# Altium schematic sheet mx8m_pmic.SchDoc (part 2 of 3)
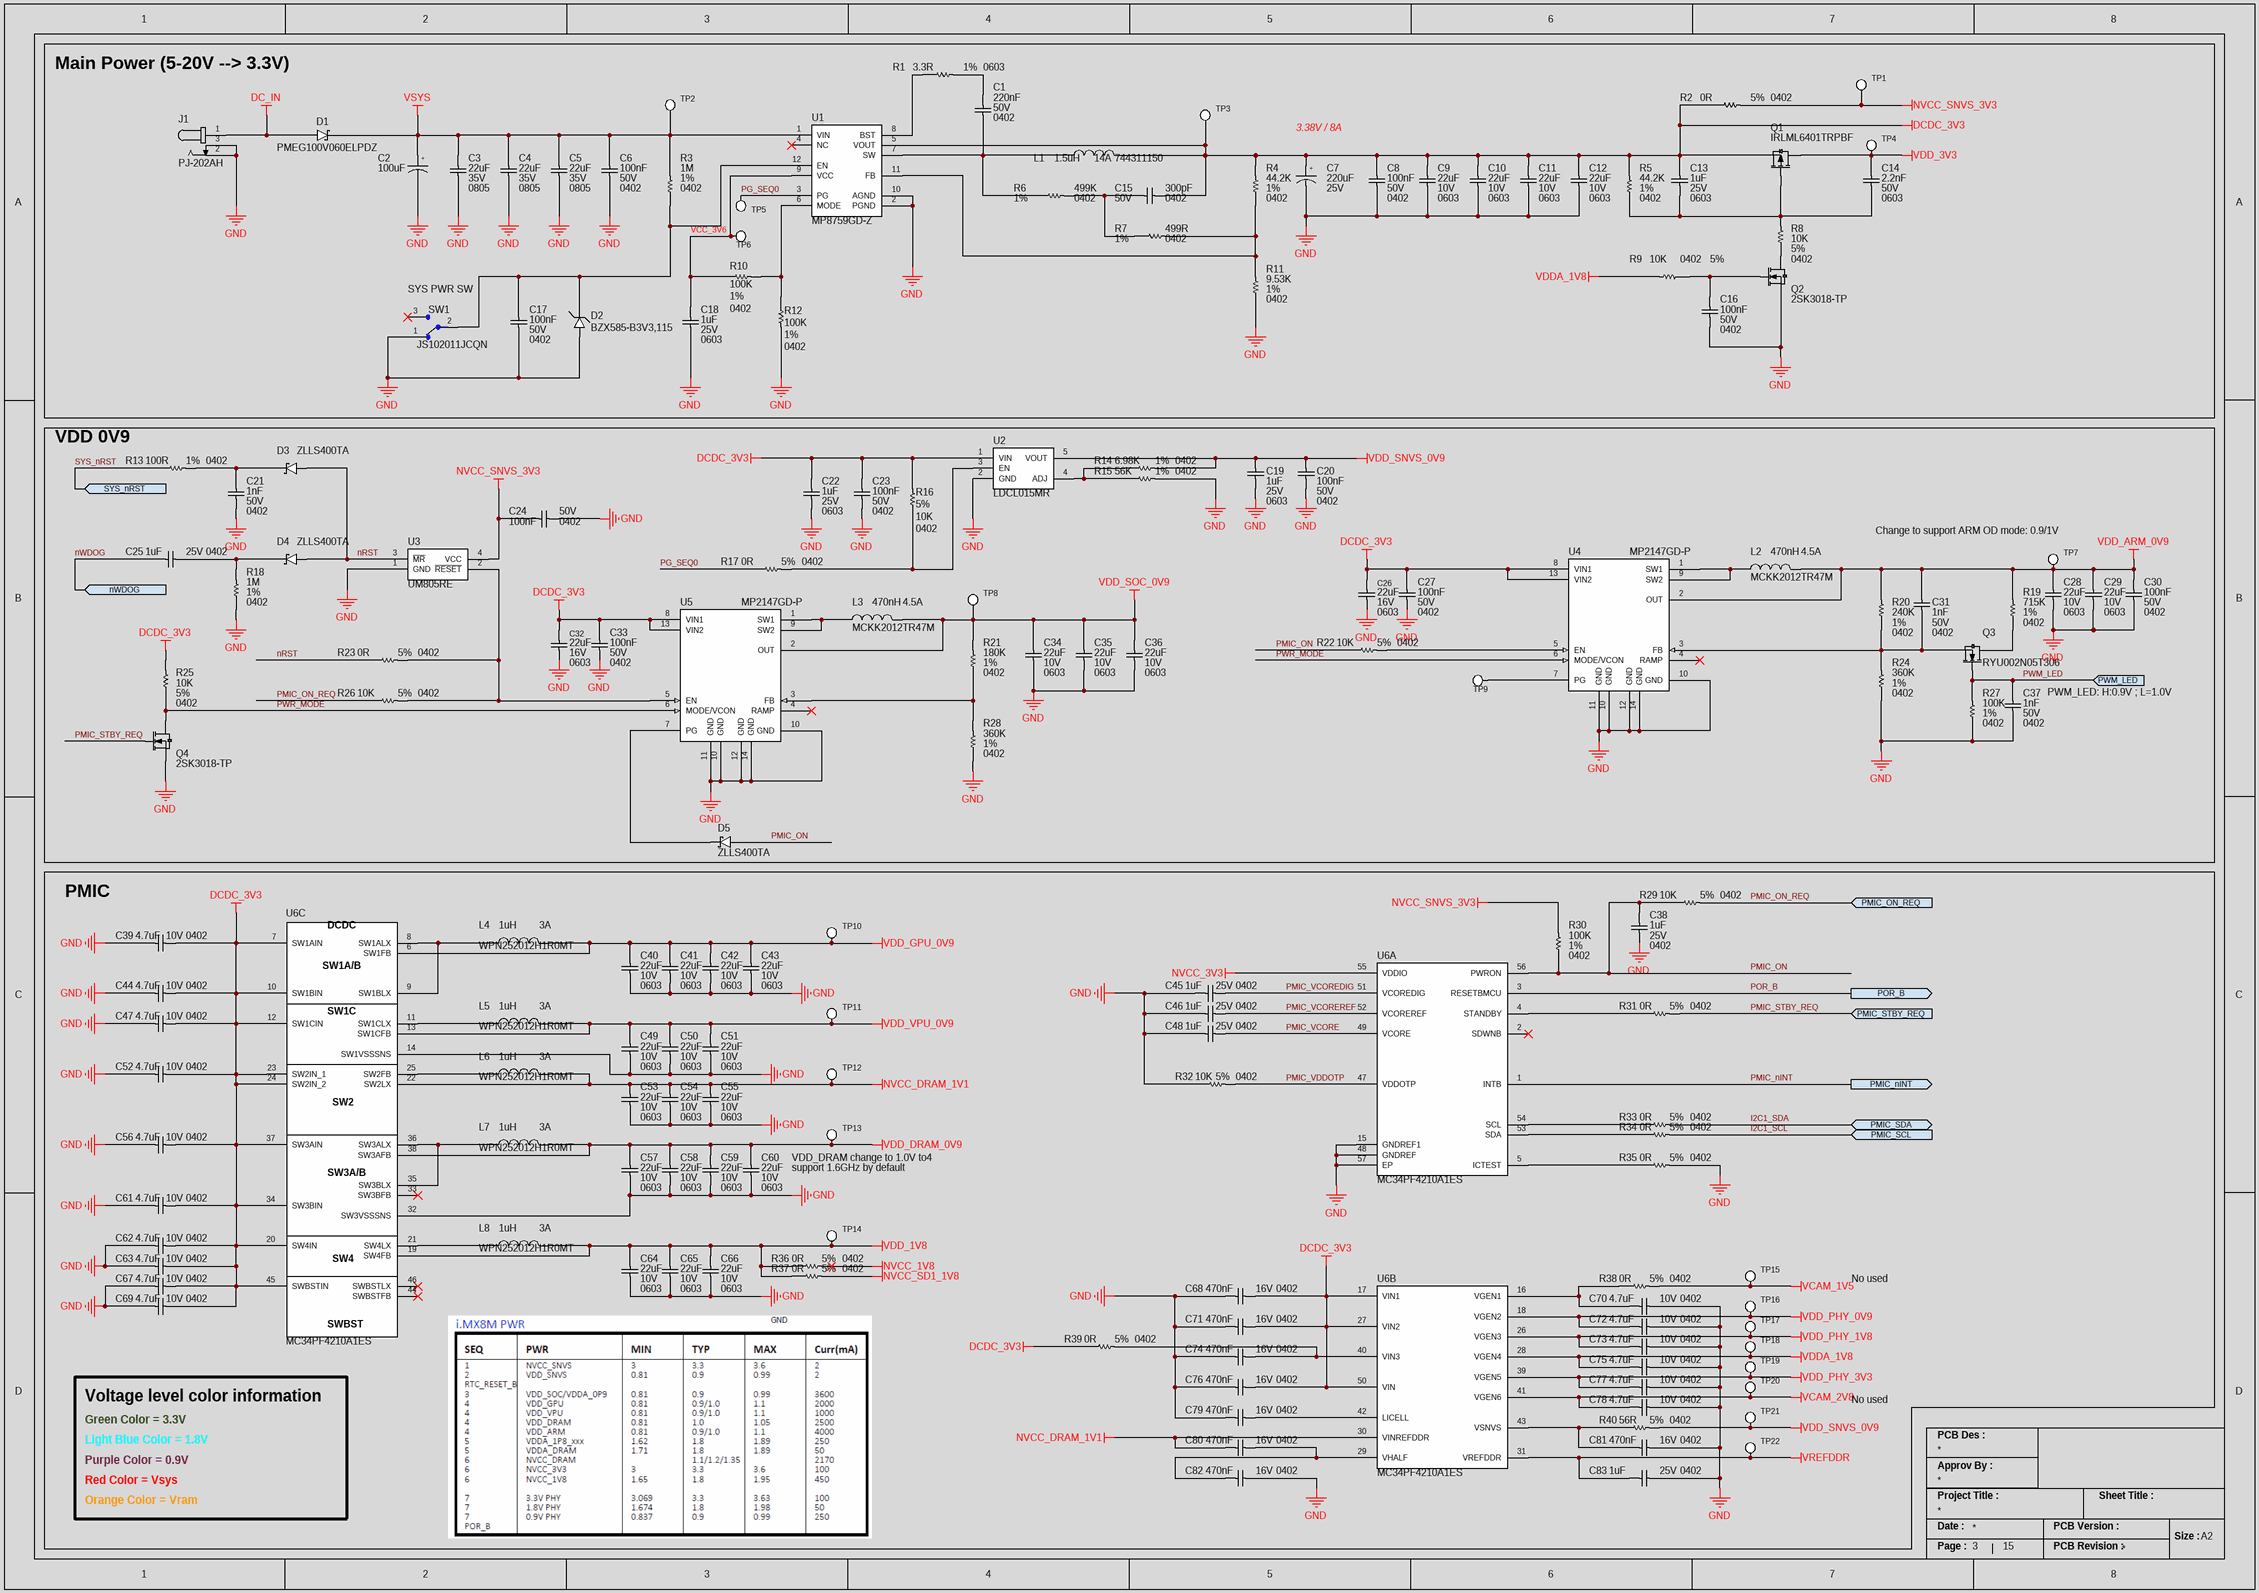
[diagram p1: mx8m_pmic.SchDoc]
## Library data of the parts
C1 = CAP_0.22UF_50V_X5R_0402: Multilayer Ceramic Capacitor, 0.22 uF, 50 VDC, ± 10%, X5R, 0402 [1005 Metric]; Manufacturer: Murata; Material: 4241ConductorMaterial; Dielectric: 1537DielectricType; Supplier 1: Digi-Key; Manufacturer Part Number: GRM155R61H224KE01W; RoHS: No; Category: Ceramic Capacitors; Stock 1: 74638; Pricing 1: 1=0.1, 10=0.048, 50=0.0272, 100=0.0212, 500=0.01592, 1000=0.01251, 2500=0.01138, 5000=0.01046 (USD); Min Operating Temperature: -55°C; Max Operating Temperature: 85°C; Voltage Rating: 50V; Length: 1mm; Width: 500um; Height: 550um; Thickness: 500um; Supplier Part Number 1: 490-GRM155R61H224KE01WCT-ND
C2 = CAP_100UF_50V_POL: Radial Can - SMD ALUMINUM ELECTROLYTIC CAPACITOR UUD 50V 100muF ±20% 0.315Dia 8.00mm; Manufacturer: Nichicon; Dielectric Material: Aluminium; Ripple Current (AC): 300mA; Impedance: 340mR; Leakage Current: 3uA; Life (Hours): 5000Hour; Dissipation Factor: 0.14%; Polarity: 5066Direction; Lead Diameter: 1.1mm; Supplier 1: Mouser; Manufacturer Part Number: UUD1H101MNL1GS; RoHS: Yes; Category: Aluminum Electrolytic Capacitors; Stock 1: 2204; Pricing 1: 1=0.53, 10=0.313, 50=0.313, 100=0.202, 500=0.202, 1000=0.171, 2500=0.151, 10000=0.138, 25000=0.136, 50000=0.131 (USD); Case/Package: Radial; Number of Pins: 2; Min Operating Temperature: -55°C; Max Operating Temperature: 105°C; Tolerance: 20%; Voltage Rating (DC): 50V; Package Quantity: 500; Ripple Current: 300mA; Packaging: Tape and Reel; Voltage Rating: 50V; Termination: SMD/SMT; Voltage: 50V; Series: UD; Construction: Cylindrical; Voltage Rating (AC): 50V; Diameter: 8mm; Length: 10mm; Height: 10mm; Lead Pitch: 3.1mm; Height - Seated (Max): 0.394inch; Radiation Hardening: No; Reach SVHC Compliant: No; Lead Free: Lead Free; RoHS Compliant: Yes; ComponentLink1URL: https://datasheet.ciiva.com/11781/0900766b80fa39e7-11781901.pdf?src-supplier=Rs; ComponentLink1Description: https://datasheet.ciiva.com/11781/0900766b80fa39e7-11781901.pdf?src-supplier=Rs; ComponentLink2URL: https://datasheet.ciiva.com/28458/e-ud-28458117.pdf?src-supplier=Element14; ComponentLink2Description: https://datasheet.ciiva.com/28458/e-ud-28458117.pdf?src-supplier=Element14; ComponentLink3URL: https://datasheet.ciiva.com/28458/1910936-28458133.pdf?src-supplier=Element14; ComponentLink3Description: https://datasheet.ciiva.com/28458/1910936-28458133.pdf?src-supplier=Element14; ComponentLink4URL: https://datasheet.ciiva.com/7781/66055-7781450.pdf?src-supplier=Element14; ComponentLink4Description: https://datasheet.ciiva.com/7781/66055-7781450.pdf?src-supplier=Element14; ComponentLink5URL: https://datasheet.ciiva.com/5362/e-ud-5362134.pdf?src-supplier=Mouser; ComponentLink5Description: https://datasheet.ciiva.com/5362/e-ud-5362134.pdf?src-supplier=Mouser; Supplier Part Number 1: 647-UUD1H101MNL
C3-C5 = CAP_22uF_35V_X5R_0805: Commercial Grade, 0805, X5R, 35V, 22; Manufacturer: TDK; Supplier 1: Digikey; Manufacturer Part Number: C2012X5R1V226M125DC; RoHS: No; Category: Ceramic Capacitors; Stock 1: 17855; Pricing 1: 1=0.97, 10=0.595, 50=0.4452, 100=0.3986, 500=0.31924, 1000=0.29446, 2500=0.26812, 5000=0.25213 (USD); Supplier Part Number 1: 445-C2012X5R1V226M125DCCT-ND
C6 C8 C16 C17 C20 C23 C24 C27 C30 C33 = CAP_100NF_50V_X7R_0402: Multilayer Ceramic Capacitor, 0.1 uF, 16 V, ± 10%, X7R, 0402 [1005 Metric]; Manufacturer: Murata; Dissipation Factor: 0.025%; Temperature Coefficient: 30ppm/°C; Supplier 1: DigiKey; Manufacturer Part Number: GRM155R71H104KE14D; RoHS: Yes; Category: Ceramic Capacitors; Stock 1: 13730790; Pricing 1: 1=0.1, 10=0.023, 50=0.0132, 100=0.0102, 500=0.00768, 1000=0.00603, 2500=0.00548, 5000=0.00504 (USD); Mount: Surface Mount; Number of Pins: 2NUMBER; Case Code (Metric): 1005; Material: Ceramic; Case Code (Imperial): 0402; Weight: 0.000212oz; Dielectric Material: Ceramic; Min Operating Temperature: -55°C; Max Operating Temperature: 125°C; Packaging: Tape and Reel; Package Quantity: 10000; Series: GRM; Tolerance: 10%; Dielectric: X7R; Termination: SMD/SMT; Voltage: 50V; Voltage Rating (DC): 50V; Construction: Flat; Length: 1mm; Width: 0.5mm; Height: 0.5mm; Depth: 0.5mm; Thickness: 0.022inch; Reach SVHC Compliant: No; RoHS Compliant: Yes; Lead Free: 5697LeadFree; ComponentLink1URL: http://www.farnell.com/datasheets/2079156.pdf?src-supplier=Farnell; ComponentLink1Description: http://www.farnell.com/datasheets/2079156.pdf?src-supplier=Farnell; ComponentLink2URL: http://www.mouser.com/ds/2/281/c02e-2905.pdf?src-supplier=Mouser; ComponentLink2Description: http://www.mouser.com/ds/2/281/c02e-2905.pdf?src-supplier=Mouser; ComponentLink3URL: http://www.farnell.com/datasheets/2079156.pdf?src-supplier=Newark; ComponentLink3Description: http://www.farnell.com/datasheets/2079156.pdf?src-supplier=Newark; ComponentLink4URL: https://datasheet.octopart.com/GRM155R71H104KE14D-Murata-datasheet-22122223.pdf?src-supplier=Future+Electronics; ComponentLink4Description: https://datasheet.octopart.com/GRM155R71H104KE14D-Murata-datasheet-22122223.pdf?src-supplier=Future+Electronics; ComponentLink5URL: https://search.murata.co.jp/Ceramy/image/img/A01X/G101/ENG/GRM155R71H104KE14-01.pdf?src-supplier=Digi-Key; ComponentLink5Description: https://search.murata.co.jp/Ceramy/image/img/A01X/G101/ENG/GRM155R71H104KE14-01.pdf?src-supplier=Digi-Key; ComponentLink6URL: http://psearch.en.murata.com/capacitor/product/GRM155R71H104KE14%23.pdf?src-supplier=Avnet; ComponentLink6Description: http://psearch.en.murata.com/capacitor/product/GRM155R71H104KE14%23.pdf?src-supplier=Avnet; ComponentLink7URL: https://datasheet.octopart.com/GRM155R71H104KE14D-Murata-datasheet-66077078.pdf?src-supplier=Element14; ComponentLink7Description: https://datasheet.octopart.com/GRM155R71H104KE14D-Murata-datasheet-66077078.pdf?src-supplier=Element14; Supplier Part Number 1: 490-10700-6-ND; Supplier 2: Digikey; Stock 2: 3706055; Pricing 2: 1=0.1, 10=0.037, 50=0.021, 100=0.0162, 500=0.01224, 1000=0.00961, 2500=0.00874, 5000=0.00804 (USD); Halogen Free: 5694HalogenFree; ComponentLink8URL: http://www.mouser.com/ds/2/447/UPY-GPHC_X5R_4V-to-50V_25-1131599.pdf?src-supplier=Mouser; ComponentLink8Description: http://www.mouser.com/ds/2/447/UPY-GPHC_X5R_4V-to-50V_25-1131599.pdf?src-supplier=Mouser; ComponentLink9URL: https://datasheet.octopart.com/CC0402KRX5R8BB104-Yageo-datasheet-137700082.pdf?src-supplier=Future+Electronics; ComponentLink9Description: https://datasheet.octopart.com/CC0402KRX5R8BB104-Yageo-datasheet-137700082.pdf?src-supplier=Future+Electronics; ComponentLink10URL: http://www.yageo.com/documents/recent/UPY-GPHC_X5R_4V-to-50V_25.pdf?src-supplier=Digikey; ComponentLink10Description: http://www.yageo.com/documents/recent/UPY-GPHC_X5R_4V-to-50V_25.pdf?src-supplier=Digikey; ComponentLink11URL: https://datasheet.octopart.com/CC0402KRX5R8BB104-Yageo-datasheet-140260304.pdf?src-supplier=Newark; ComponentLink11Description: https://datasheet.octopart.com/CC0402KRX5R8BB104-Yageo-datasheet-140260304.pdf?src-supplier=Newark; ComponentLink12URL: https://datasheet.octopart.com/CC0402KRX5R8BB104-Yageo-datasheet-170350636.pdf?src-supplier=Future+Electronics; ComponentLink12Description: https://datasheet.octopart.com/CC0402KRX5R8BB104-Yageo-datasheet-170350636.pdf?src-supplier=Future+Electronics; ComponentLink13URL: http://www.yageo.com/documents/recent/UPY-GPHC_X5R_4V-to-50V-16.pdf?src-supplier=Future+Electronics; ComponentLink13Description: http://www.yageo.com/documents/recent/UPY-GPHC_X5R_4V-to-50V-16.pdf?src-supplier=Future+Electronics; Supplier Part Number 2: 311-1697-1-ND
C7 = CAP_220uF_EEV227M025A9MAA: Cap Aluminum Lytic 220uF 25V 20% (8 X 10.2mm) SMD 600mA 2000h 105C T/R; Manufacturer: KEMET; ESR (Equivalent Series Resistance): 160mR; Supplier 1: Digikey; Manufacturer Part Number: EEV227M025A9MAA; RoHS: Yes; Category: Capacitors; Stock 1: 20821; Pricing 1: 1=0.58, 10=0.39, 50=0.3102, 100=0.2562 (USD); Mount: Surface Mount; Case/Package: Radial; Min Operating Temperature: -55°C; Max Operating Temperature: 105°C; Series: EEV; Packaging: Cut Tape; Tolerance: 20%; Impedance: 160mR; RoHS Compliant: Yes; ComponentLink1URL: https://datasheet.octopart.com/EEV227M025A9MAA-KEMET-datasheet-130072785.pdf?src-supplier=Farnell; ComponentLink1Description: https://datasheet.octopart.com/EEV227M025A9MAA-KEMET-datasheet-130072785.pdf?src-supplier=Farnell; Supplier Part Number 1: 399-18140-1-ND
C9-C12 C28 C29 C34-C36 C40-C43 C49-C51 C53-C55 C57-C60 C64-C66 = CAP_22UF_10V_X5R_0603: Multilayer Ceramic Capacitor, 22 uF, 10 V, ± 20%, X5R, 0603 [1608 Metric]; Manufacturer: TDK; Supplier 1: Digi-Key; Manufacturer Part Number: C1608X5R1A226M080AC; RoHS: Yes; Category: Ceramic Capacitors; Stock 1: 1971709; Pricing 1: 1=0.32, 10=0.208, 50=0.1534, 100=0.1248, 500=0.09856, 1000=0.08323 (USD); Mount: Surface Mount; Case/Package: 0603; Case Code (Metric): 1608; Dielectric Material: Ceramic; Weight: 7.1E-05oz; Min Operating Temperature: -55°C; Max Operating Temperature: 85°C; Tolerance: 20%; Packaging: Tape and Reel; Voltage Rating (DC): 10V; Termination: SMD/SMT; Series: C; Package Quantity: 4000; Dielectric: X5R; Length: 1.6mm; Width: 0.8mm; Height: 0.8mm; Reach SVHC Compliant: No; Lead Free: Lead Free; RoHS Compliant: Yes; ComponentLink1URL: https://datasheet.ciiva.com/6274/tdkmlcccaprange-6274860.pdf?src-supplier=Digi-Key; ComponentLink1Description: https://datasheet.ciiva.com/6274/tdkmlcccaprange-6274860.pdf?src-supplier=Digi-Key; ComponentLink2URL: https://datasheet.ciiva.com/6274/tdkmlcccaprange-6274859.pdf?src-supplier=Digi-Key; ComponentLink2Description: https://datasheet.ciiva.com/6274/tdkmlcccaprange-6274859.pdf?src-supplier=Digi-Key; ComponentLink3URL: https://datasheet.ciiva.com/6274/tdkmlcccaprange-6274861.pdf?src-supplier=Digi-Key; ComponentLink3Description: https://datasheet.ciiva.com/6274/tdkmlcccaprange-6274861.pdf?src-supplier=Digi-Key; ComponentLink4URL: https://datasheet.ciiva.com/24216/mlcc-commercial-general-en-24216575.pdf?src-supplier=Mouser; ComponentLink4Description: https://datasheet.ciiva.com/24216/mlcc-commercial-general-en-24216575.pdf?src-supplier=Mouser; Supplier Part Number 1: 445-9077-1-ND
C13 C18 C19 C22 = CAP_1uF_25V_X7R_0603: Multilayer Ceramic Capacitor, 1 uF, 25 V, ± 10%, X7R, 0603 [1608 Metric]; Manufacturer: Murata; Material: 4241ConductorMaterial; Supplier 1: Mouser; Manufacturer Part Number: GCM188R71E105KA64D; RoHS: Yes; Category: Ceramic Capacitors; Stock 1: 413087; Pricing 1: 1=0.22, 10=0.089, 50=0.089, 100=0.052, 1000=0.046, 10000=0.035 (USD); Mount: Surface Mount; Case Code (Metric): 1608; Case Code (Imperial): 0603; Weight: 0.000222oz; Min Operating Temperature: -55°C; Max Operating Temperature: 125°C; Tolerance: 10%; Packaging: Tape and Reel; Dielectric: X7R; Voltage: 25V; Termination: SMD/SMT; Voltage Rating (DC): 25V; Package Quantity: 4000; Series: GCM; Construction: Flat; Length: 1.6mm; Width: 0.031inch; Height: 0.8mm; Thickness: 0.035inch; Depth: 0.8mm; Ratings: AEC-Q200; Radiation Hardening: No; Reach SVHC Compliant: No; Lead Free: Lead Free; RoHS Compliant: Yes; ComponentLink1URL: https://datasheet.ciiva.com/11616/product-11616499.pdf?src-supplier=Avnet; ComponentLink1Description: https://datasheet.ciiva.com/11616/product-11616499.pdf?src-supplier=Avnet; Supplier Part Number 1: 81-GCM188R71E105KA4D
C14 = CAP_2.2nF_50V_NP0_0402: Multilayer Ceramic Capacitor, 2200 pF, 50 V, ï¿½ 5%, C0G (NP0), 0603 [1608 Metric]; Manufacturer: Murata; Insulation Resistance: 10GR; Temperature Coefficient: 30ppm/°C; Supplier 1: Digikey; Manufacturer Part Number: GRM1885C1H222JA01D; RoHS: Yes; Category: Ceramic Capacitors; Stock 1: 228613; Pricing 1: 1=0.1, 10=0.045, 50=0.0306, 100=0.0262, 500=0.01882, 1000=0.01654 (USD); Mount: Surface Mount; Number of Pins: 2; Case Code (Imperial): 0603; Case Code (Metric): 1608; Material: Ceramic; Dielectric Material: Ceramic; Min Operating Temperature: -55°C; Max Operating Temperature: 125°C; Tolerance: 5%; Packaging: Tape and Reel; Voltage Rating (DC): 50V; Package Quantity: 1; Dielectric: C0G; Termination: SMD/SMT; Voltage: 50V; Series: GRM; Construction: Flat; Length: 1.6mm; Width: 0.031inch; Height: 0.8mm; Thickness: 0.035inch; Depth: 0.8mm; Reach SVHC Compliant: No; Lead Free: Lead Free; RoHS Compliant: Yes; ComponentLink1URL: https://datasheet.ciiva.com/3777/1632grm1885c1h222ja0123-3777835.pdf?src-supplier=Arrow+Electronics; ComponentLink1Description: https://datasheet.ciiva.com/3777/1632grm1885c1h222ja0123-3777835.pdf?src-supplier=Arrow+Electronics; ComponentLink2URL: https://datasheet.ciiva.com/11786/0900766b807a1cab-11786840.pdf?src-supplier=Rs; ComponentLink2Description: https://datasheet.ciiva.com/11786/0900766b807a1cab-11786840.pdf?src-supplier=Rs; ComponentLink3URL: https://datasheet.ciiva.com/133/partnumbering-e-01-133576.pdf?src-supplier=Digikey; ComponentLink3Description: https://datasheet.ciiva.com/133/partnumbering-e-01-133576.pdf?src-supplier=Digikey; ComponentLink4URL: https://datasheet.ciiva.com/133/partnumbering-e-01-133577.pdf?src-supplier=Digikey; ComponentLink4Description: https://datasheet.ciiva.com/133/partnumbering-e-01-133577.pdf?src-supplier=Digikey; ComponentLink5URL: https://datasheet.ciiva.com/133/partnumbering-e-01-133578.pdf?src-supplier=Digikey; ComponentLink5Description: https://datasheet.ciiva.com/133/partnumbering-e-01-133578.pdf?src-supplier=Digikey; ComponentLink6URL: https://datasheet.ciiva.com/11463/product-11463974.pdf?src-supplier=Avnet; ComponentLink6Description: https://datasheet.ciiva.com/11463/product-11463974.pdf?src-supplier=Avnet; ComponentLink7URL: https://datasheet.ciiva.com/2989/product-2989459.pdf?src-supplier=Avnet; ComponentLink7Description: https://datasheet.ciiva.com/2989/product-2989459.pdf?src-supplier=Avnet; ComponentLink8URL: https://datasheet.ciiva.com/6031/4360-6031797.pdf?src-supplier=Farnell; ComponentLink8Description: https://datasheet.ciiva.com/6031/4360-6031797.pdf?src-supplier=Farnell; ComponentLink9URL: https://datasheet.ciiva.com/7828/4360-7828918.pdf?src-supplier=Element14; ComponentLink9Description: https://datasheet.ciiva.com/7828/4360-7828918.pdf?src-supplier=Element14; ComponentLink10URL: https://datasheet.ciiva.com/7828/1747455-7828919.pdf?src-supplier=Element14; ComponentLink10Description: https://datasheet.ciiva.com/7828/1747455-7828919.pdf?src-supplier=Element14; ComponentLink11URL: https://datasheet.ciiva.com/7828/1747455-7828920.pdf?src-supplier=Element14; ComponentLink11Description: https://datasheet.ciiva.com/7828/1747455-7828920.pdf?src-supplier=Element14; Supplier Part Number 1: 490-1459-1-ND
C15 = CAP_300pF_50V_NP0_0402: Cap Ceramic 300pF 50V C0G 5% SMD 0402 125°C Paper T/R; Manufacturer: Murata; Temperature Coefficient: 30ppm/°C; Supplier 1: Digikey; Manufacturer Part Number: GCM1555C1H301JA16D; RoHS: Yes; Category: Ceramic Capacitors; Stock 1: 94255; Pricing 1: 1=0.1, 10=0.049, 50=0.0334, 100=0.0287, 500=0.02068, 1000=0.0182, 2500=0.01557, 5000=0.01398 (USD); Mount: Surface Mount; Case/Package: 0402; Case Code (Metric): 1005; Material: Ceramic; Min Operating Temperature: -25°C; Max Operating Temperature: 125°C; Voltage Rating (DC): 50V; Tolerance: 5%; Packaging: Tape and Reel; Package Quantity: 10000; Dielectric: C0G; Termination: SMD/SMT; Series: GCM; Construction: Flat; Length: 1mm; Width: 0.5mm; Height: 0.5mm; Depth: 0.5mm; Ratings: AEC-Q200; Radiation Hardening: No; RoHS Compliant: Yes; ComponentLink1URL: https://datasheet.ciiva.com/11604/product-11604896.pdf?src-supplier=Avnet; ComponentLink1Description: https://datasheet.ciiva.com/11604/product-11604896.pdf?src-supplier=Avnet; ComponentLink2URL: https://datasheet.ciiva.com/164/s0717e-164794.pdf?src-supplier=Digikey; ComponentLink2Description: https://datasheet.ciiva.com/164/s0717e-164794.pdf?src-supplier=Digikey; Supplier Part Number 1: 490-GCM1555C1H301JA16DCT-ND
C21 C31 C37 = CAP_1000pF_50V_NP0_0402: Multilayer Ceramic Capacitor, 1000 pF, 50 V, ± 5%, C0G (NP0), 0402 [1005 Metric]; Manufacturer: Murata; Dielectric Material: 4241ConductorMaterial; Insulation Resistance: 10GR; Temperature Coefficient: 30ppm/°C; Supplier 1: Digi-Key; Manufacturer Part Number: GRM1555C1H102JA01D; RoHS: Yes; Category: Ceramic Capacitors; Stock 1: 22370735; Pricing 1: 1=0.1, 10=0.032, 50=0.0186, 100=0.0144, 500=0.01086, 1000=0.00853, 2500=0.00776, 5000=0.00714 (USD); Mount: Surface Mount; Case/Package: 0402; Number of Pins: 2; Case Code (Metric): 1005; Material: Ceramic; Min Operating Temperature: -55°C; Max Operating Temperature: 125°C; Package Quantity: 1; Tolerance: 5%; Packaging: Tape and Reel; Voltage Rating (DC): 50V; Dielectric: C0G; Termination: SMD/SMT; Voltage: 50V; Series: GRM; Construction: Flat; Length: 1mm; Width: 0.5mm; Height: 0.5mm; Thickness: 0.022inch; Depth: 0.5mm; Size: 0.5mm; Radiation Hardening: No; Reach SVHC Compliant: No; RoHS Compliant: Yes; Lead Free: 5697LeadFree; ComponentLink1URL: https://datasheet.ciiva.com/34302/1855908-34302849.pdf?src-supplier=Jameco; ComponentLink1Description: https://datasheet.ciiva.com/34302/1855908-34302849.pdf?src-supplier=Jameco; ComponentLink2URL: https://datasheet.ciiva.com/132/product-132800.pdf?src-supplier=Digi-Key; ComponentLink2Description: https://datasheet.ciiva.com/132/product-132800.pdf?src-supplier=Digi-Key; ComponentLink3URL: https://datasheet.ciiva.com/132/grm1555c1h102ja01-01-132799.pdf?src-supplier=Digi-Key; ComponentLink3Description: https://datasheet.ciiva.com/132/grm1555c1h102ja01-01-132799.pdf?src-supplier=Digi-Key; ComponentLink4URL: https://datasheet.ciiva.com/18184/getdatasheetpartid-90260-18184180.pdf?src-supplier=Verical; ComponentLink4Description: https://datasheet.ciiva.com/18184/getdatasheetpartid-90260-18184180.pdf?src-supplier=Verical; ComponentLink5URL: https://datasheet.ciiva.com/7828/4360-7828821.pdf?src-supplier=Element14; ComponentLink5Description: https://datasheet.ciiva.com/7828/4360-7828821.pdf?src-supplier=Element14; ComponentLink6URL: https://datasheet.ciiva.com/14116/grmseries-tc-hitype-eng-14116858.pdf?src-supplier=Distrelec; ComponentLink6Description: https://datasheet.ciiva.com/14116/grmseries-tc-hitype-eng-14116858.pdf?src-supplier=Distrelec; ComponentLink7URL: https://datasheet.ciiva.com/132/grm1555c1h102ja01-01-132801.pdf?src-supplier=Digi-Key; ComponentLink7Description: https://datasheet.ciiva.com/132/grm1555c1h102ja01-01-132801.pdf?src-supplier=Digi-Key; Supplier Part Number 1: 490-3244-1-ND
C25 C38 C45 C46 C48 C83 = CAP_1UF_25V_X5R_0402: Multilayer Ceramic Capacitor, 1 uF, 25 V, ± 10%, X5R, 0402 [1005 Metric]; Manufacturer: Murata; Supplier 1: Digi-Key; Manufacturer Part Number: GRM155R61E105KA12D; RoHS: Yes; Category: Ceramic Capacitors; Stock 1: 849086; Pricing 1: 1=0.1, 10=0.043, 50=0.0246, 100=0.019, 500=0.01434, 1000=0.01126, 2500=0.01024, 5000=0.00942 (USD); Mount: Surface Mount; Case/Package: 0402; Case Code (Metric): 1005; Material: Ceramic; Weight: 0.000212oz; Min Operating Temperature: -55°C; Max Operating Temperature: 85°C; Tolerance: 10%; Packaging: Cut Tape; Dielectric: X5R; Voltage: 25V; Termination: SMD/SMT; Voltage Rating (DC): 25V; Package Quantity: 10000; Series: GRM; Length: 1mm; Width: 0.5mm; Height: 0.5mm; Thickness: 0.022inch; Depth: 0.5mm; Reach SVHC Compliant: No; Lead Free: Lead Free; RoHS Compliant: Yes; ComponentLink1URL: https://datasheet.ciiva.com/7719/1666664-7719006.pdf?src-supplier=Element14; ComponentLink1Description: https://datasheet.ciiva.com/7719/1666664-7719006.pdf?src-supplier=Element14; ComponentLink2URL: https://datasheet.ciiva.com/22732/1666664-22732122.pdf?src-supplier=Element14; ComponentLink2Description: https://datasheet.ciiva.com/22732/1666664-22732122.pdf?src-supplier=Element14; Supplier Part Number 1: 490-10017-1-ND
C26 C32 = CAP_22UF_16V_X5R_0603: Cap Ceramic 22uF 16V X5R 20% Pad SMD 0603 85C T/R; Manufacturer: Samsung; Supplier 1: Digi-Key; Manufacturer Part Number: CL10A226MO7JZNC; RoHS: Yes; Category: Ceramic Capacitors; Stock 1: 1760065; Pricing 1: 1=0.59, 10=0.419, 50=0.3164, 100=0.2756, 500=0.20418, 1000=0.17355 (USD); Mount: Surface Mount; Case Code (Imperial): 0603; Case Code (Metric): 1608; Min Operating Temperature: -55°C; Max Operating Temperature: 85°C; Packaging: Cut Tape; Tolerance: 20%; Series: CL; RoHS Compliant: Yes; ComponentLink1URL: http://www.samsungsem.com/kr/support/product-search/mlcc/CL10A226MO7JZNC.jsp?src-supplier=Digi-Key; ComponentLink1Description: http://www.samsungsem.com/kr/support/product-search/mlcc/CL10A226MO7JZNC.jsp?src-supplier=Digi-Key; ComponentLink2URL: https://datasheet.octopart.com/CL10A226MO7JZNC-Samsung-Electro-Mechanics-datasheet-149156497.pdf?src-supplier=Future+Electronics; ComponentLink2Description: https://datasheet.octopart.com/CL10A226MO7JZNC-Samsung-Electro-Mechanics-datasheet-149156497.pdf?src-supplier=Future+Electronics; Supplier Part Number 1: 1276-7076-1-ND
C39 C44 C47 C52 C56 C61-C63 C67 C69 C70 C72 C73 C75 C77 C78 = CAP_4.7UF_10V_X5R_0402: Multilayer Ceramic Capacitor, 4.7 uF, 10 V, ± 10%, X5R, 0402 [1005 Metric]; Manufacturer: Samsung; Supplier 1: Digikey; Manufacturer Part Number: CL05A475KP5NRNC; RoHS: Yes; Category: Ceramic Capacitors; Stock 1: 748042; Pricing 1: 1=0.28, 10=0.184, 50=0.129, 100=0.1042, 500=0.0774, 1000=0.06772, 2500=0.0645, 5000=0.05966 (USD); Mount: Surface Mount; Case Code (Metric): 1005; Case Code (Imperial): 0402; Material: Ceramic; Min Operating Temperature: -55°C; Max Operating Temperature: 85°C; Tolerance: 10%; Packaging: Tape and Reel; Package Quantity: 1; Dielectric: X5R; Series: CL; Construction: Flat; Length: 1mm; Width: 0.02inch; Height: 0.5mm; Thickness: 0.022inch; Depth: 0.5mm; Radiation Hardening: No; RoHS Compliant: Yes; Lead Free: Lead Free; ComponentLink1URL: https://datasheet.ciiva.com/25724/cl05a475kp5nrnc-25724404.pdf?src-supplier=Digikey; ComponentLink1Description: https://datasheet.ciiva.com/25724/cl05a475kp5nrnc-25724404.pdf?src-supplier=Digikey; ComponentLink2URL: https://datasheet.ciiva.com/29198/458873-da-01-en-vs-kondensator-0402-29198304.pdf?src-supplier=Conrad; ComponentLink2Description: https://datasheet.ciiva.com/29198/458873-da-01-en-vs-kondensator-0402-29198304.pdf?src-supplier=Conrad; Supplier Part Number 1: 1276-1480-1-ND
C68 C71 C74 C76 C79-C82 = CAP_0.47UF_16V_X5R_0402: 0402 0.47 uF 16 V ±10 % Tolerance X5R SMT Multilayer Ceramic Capacitor; Manufacturer: Murata; Tolerance: 10%; Supplier 1: Digi-Key; Manufacturer Part Number: GRT155R61C474KE01D; RoHS: Yes; Category: Ceramic Capacitors; Stock 1: 1892752; Pricing 1: 1=0.4, 10=0.27, 50=0.215, 100=0.1775, 500=0.13868, 1000=0.11788, 2500=0.11095, 5000=0.10401 (USD); Mount: Surface Mount; Case Code (Metric): 1005; Case Code (Imperial): 0402; Min Operating Temperature: -55°C; Max Operating Temperature: 85°C; Packaging: Cut Tape; Series: GRT; Length: 0.039inch; Width: 0.02inch; Thickness: 0.022inch; Ratings: AEC-Q200; RoHS Compliant: Yes; ComponentLink1URL: http://search.murata.co.jp/Ceramy/image/img/A01X/G101/ENG/GRT155R61C474KE01-01.pdf?src-supplier=Digi-Key; ComponentLink1Description: http://search.murata.co.jp/Ceramy/image/img/A01X/G101/ENG/GRT155R61C474KE01-01.pdf?src-supplier=Digi-Key; ComponentLink2URL: https://datasheet.octopart.com/GRT155R61C474KE01D-Murata-datasheet-149523552.pdf?src-supplier=Newark; ComponentLink2Description: https://datasheet.octopart.com/GRT155R61C474KE01D-Murata-datasheet-149523552.pdf?src-supplier=Newark; ComponentLink3URL: https://datasheet.octopart.com/GRT155R61C474KE01D-Murata-datasheet-82944871.pdf?src-supplier=Future+Electronics; ComponentLink3Description: https://datasheet.octopart.com/GRT155R61C474KE01D-Murata-datasheet-82944871.pdf?src-supplier=Future+Electronics; ComponentLink4URL: https://datasheet.octopart.com/GRT155R61C474KE01D-Murata-datasheet-165579666.pdf?src-supplier=TME; ComponentLink4Description: https://datasheet.octopart.com/GRT155R61C474KE01D-Murata-datasheet-165579666.pdf?src-supplier=TME; Supplier Part Number 1: 490-12261-6-ND
D1 = DIO_SCTKY_100V_6A_PMEG100V060ELPDZ: DIODESCHOTTKY100V6ACFP15; Manufacturer: Nexperia; Supplier 1: Digikey; Manufacturer Part Number: PMEG100V060ELPDZ; RoHS: Yes; Category: Schottky Diodes; Stock 1: 60422; Pricing 1: 1=0.58, 10=0.504, 100=0.3491, 500=0.29166 (USD); RoHS Compliant: Yes; ComponentLink1URL: http://www.farnell.com/datasheets/2341403.pdf?src-supplier=Farnell; ComponentLink1Description: http://www.farnell.com/datasheets/2341403.pdf?src-supplier=Farnell; ComponentLink2URL: https://datasheet.octopart.com/PMEG100V060ELPDZ-Nexperia-datasheet-87796136.pdf?src-supplier=Future+Electronics; ComponentLink2Description: https://datasheet.octopart.com/PMEG100V060ELPDZ-Nexperia-datasheet-87796136.pdf?src-supplier=Future+Electronics
D2 = DIO_ZENER_3.3V_300mW_BZX585-B3V3,115: DIODE ZENER 3.3V 300MW SOD523; Manufacturer: Nexperia; Supplier 1: Mouser; Manufacturer Part Number: BZX585-B3V3,115; RoHS: Yes; Category: Zener Diodes; Stock 1: 47007; Pricing 1: 1=0.38, 10=0.258, 50=0.258, 100=0.105, 1000=0.073, 3000=0.054, 9000=0.048, 10000=0.048, 24000=0.044, 45000=0.042, 99000=0.037 (USD); RoHS Compliant: Yes; ComponentLink1URL: http://www.farnell.com/datasheets/2174102.pdf?src-supplier=Farnell; ComponentLink1Description: http://www.farnell.com/datasheets/2174102.pdf?src-supplier=Farnell; ComponentLink2URL: https://assets.nexperia.com/documents/data-sheet/BZX585_SERIES.pdf?src-supplier=Digikey; ComponentLink2Description: https://assets.nexperia.com/documents/data-sheet/BZX585_SERIES.pdf?src-supplier=Digikey; ComponentLink3URL: https://datasheet.octopart.com/BZX585-B3V3%2C115-Nexperia-datasheet-81456219.pdf?src-supplier=Future+Electronics; ComponentLink3Description: https://datasheet.octopart.com/BZX585-B3V3%2C115-Nexperia-datasheet-81456219.pdf?src-supplier=Future+Electronics; Supplier Part Number 1: 771-BZX585-B3V3115
D3-D5 = DIO_SCTKY_40V_520mA_ZLLS400TA: DIODE SCHOTTKY 40V 520MA SOD323; Manufacturer: Diodes Zetex; Peak Non-Repetitive Surge Current: 12A; Max Reverse Current: 10uA; Forward Voltage: 800mV; Reverse Recovery Time: 3ns; Max Forward Surge Current (Ifsm): 2.5A; Power Dissipation: 330mW; Polarity: Standard; Capacitance: 15pF; Supplier 1: Digi-Key; Manufacturer Part Number: ZLLS400TA; RoHS: Yes; Category: Rectifier Diodes; Stock 1: 46017; Pricing 1: 1=0.42, 10=0.359, 100=0.2495, 500=0.19478, 1000=0.15832 (USD); Mount: Surface Mount; Number of Pins: 2; Weight: 0.000173oz; Min Operating Temperature: -55°C; Max Operating Temperature: 150°C; Forward Current: 520mA; Max Repetitive Reverse Voltage (Vrrm): 40V; Package Quantity: 3000; Packaging: Tape and Reel; Average Rectified Current: 520mA; Termination: SMD/SMT; Voltage Rating (DC): 40V; Current Rating: 520mA; Output Current: 520mA; Max Reverse Voltage (DC): 40V; Series: -; Length: 1.8mm; Width: 1.4mm; Height: 0.8mm; Radiation Hardening: No; Lead Free: Lead Free; RoHS Compliant: Yes; ComponentLink1URL: https://datasheet.ciiva.com/914/zlls400-914210.pdf?src-supplier=Digi-Key; ComponentLink1Description: https://datasheet.ciiva.com/914/zlls400-914210.pdf?src-supplier=Digi-Key; ComponentLink2URL: https://datasheet.ciiva.com/914/zlls400-914210.pdf?src-supplier=Avnet; ComponentLink2Description: https://datasheet.ciiva.com/914/zlls400-914210.pdf?src-supplier=Avnet; ComponentLink3URL: https://datasheet.ciiva.com/4715/zlls400-4715517.pdf?src-supplier=Mouser; ComponentLink3Description: https://datasheet.ciiva.com/4715/zlls400-4715517.pdf?src-supplier=Mouser; ComponentLink4URL: https://datasheet.ciiva.com/16379/zlls400-16379288.pdf?src-supplier=Future+Electronics; ComponentLink4Description: https://datasheet.ciiva.com/16379/zlls400-16379288.pdf?src-supplier=Future+Electronics; ComponentLink5URL: https://datasheet.ciiva.com/914/zlls400-914211.pdf?src-supplier=Digi-Key; ComponentLink5Description: https://datasheet.ciiva.com/914/zlls400-914211.pdf?src-supplier=Digi-Key; ComponentLink6URL: https://datasheet.ciiva.com/914/zlls400-914212.pdf?src-supplier=Digi-Key; ComponentLink6Description: https://datasheet.ciiva.com/914/zlls400-914212.pdf?src-supplier=Digi-Key; Supplier Part Number 1: ZLLS400TACT-ND
J1 = CONN_DC_JACK_2X6.5mm_PJ-202AH: 2.0 x 6.5 mm, 5.0 A, Horizontal, Through Hole, Kinked Pins, Dc Power Jack Connector; Manufacturer: CUI Devices; Body Color: Black; Shielding: Unshielded; Gender: Male; Supplier 1: Digi-Key; Manufacturer Part Number: PJ-202AH; RoHS: Yes; Category: Power Connectors; Stock 1: 143167; Pricing 1: 1=0.78, 25=0.6528, 100=0.5988, 500=0.48902, 2500=0.40274, 10000=0.36162 (USD); Mount: Through Hole; Contact Plating: Silver; Contact Material: Brass; Housing Material: PBT; Min Operating Temperature: -25°C; Max Operating Temperature: 85°C; Connector Type: Jack; Termination: Kinked Pin; Series: -; Flammability Rating: UL94 V-0; ComponentLink1URL: https://datasheet.octopart.com/PJ-202AH-CUI-Devices-datasheet-137760703.pdf?src-supplier=Future+Electronics; ComponentLink1Description: https://datasheet.octopart.com/PJ-202AH-CUI-Devices-datasheet-137760703.pdf?src-supplier=Future+Electronics; ComponentLink2URL: https://datasheet.octopart.com/PJ-202AH-CUI-datasheet-54017.pdf?src-supplier=Digi-Key; ComponentLink2Description: https://datasheet.octopart.com/PJ-202AH-CUI-datasheet-54017.pdf?src-supplier=Digi-Key; ComponentLink3URL: https://datasheet.octopart.com/PJ-202AH-CUI-Devices-datasheet-141002001.pdf?src-supplier=Electro+Sonic; ComponentLink3Description: https://datasheet.octopart.com/PJ-202AH-CUI-Devices-datasheet-141002001.pdf?src-supplier=Electro+Sonic; Supplier Part Number 1: CP-202AH-ND
L1 = IND_1.5uH_11A_744311150: Power Choke Shielded Wirewound 1.5uH/1.12uH 20% 100KHz 11A 6.6mOhm DCR T/R; Manufacturer: Wurth Electronics; DC Resistance (DCR): 6.6mR; Self Resonant Frequency: 72MHz; Series Resistance: 6.6R; Supplier 1: Digikey; Manufacturer Part Number: 744311150; RoHS: Yes; Category: Fixed Inductors; Stock 1: 12000; Pricing 1: 1=3.8, 10=3.72, 50=3.44, 100=3.29, 500=3.08 (USD); Mount: Surface Mount; Case/Package: 7040; Number of Pins: 2; Min Operating Temperature: -40°C; Max Operating Temperature: 150°C; Tolerance: 20%; Packaging: Tape and Reel; Shielding: Shielded; Package Quantity: 1; Test Frequency: 100kHz; Max DC Current: 11A; Termination: SMD/SMT; Series: WE-HCI; Inductance Tolerance: 20%; Current Rating: 11A; RMS Current (Irms): 11A; Length: 7mm; Width: 6.9mm; Height: 3.8mm; Height - Seated (Max): 0.157inch; Depth: 7.2mm; Ratings: AEC-Q200; RoHS Compliant: Yes; Lead Free: Lead Free; Reach SVHC Compliant: Unknown; Military Standard: Not; ComponentLink1URL: https://datasheet.ciiva.com/7354/744311150-7354372.pdf?src-supplier=Newark; ComponentLink1Description: https://datasheet.ciiva.com/7354/744311150-7354372.pdf?src-supplier=Newark; ComponentLink2URL: https://datasheet.ciiva.com/7765/1735736-7765005.pdf?src-supplier=Element14; ComponentLink2Description: https://datasheet.ciiva.com/7765/1735736-7765005.pdf?src-supplier=Element14; ComponentLink3URL: https://datasheet.ciiva.com/4954/744311150-54367-4954829.pdf?src-supplier=Mouser; ComponentLink3Description: https://datasheet.ciiva.com/4954/744311150-54367-4954829.pdf?src-supplier=Mouser; ComponentLink4URL: https://datasheet.ciiva.com/11801/0900766b80f886c8-11801798.pdf?src-supplier=Rs; ComponentLink4Description: https://datasheet.ciiva.com/11801/0900766b80f886c8-11801798.pdf?src-supplier=Rs; ComponentLink5URL: https://datasheet.ciiva.com/26307/744311150-eng-tds-26307909.pdf?src-supplier=Distrelec; ComponentLink5Description: https://datasheet.ciiva.com/26307/744311150-eng-tds-26307909.pdf?src-supplier=Distrelec; ComponentLink6URL: https://datasheet.ciiva.com/6692/744311150-6692686.pdf?src-supplier=Digikey; ComponentLink6Description: https://datasheet.ciiva.com/6692/744311150-6692686.pdf?src-supplier=Digikey; ComponentLink7URL: https://datasheet.ciiva.com/6692/744311150-6692685.pdf?src-supplier=Digikey; ComponentLink7Description: https://datasheet.ciiva.com/6692/744311150-6692685.pdf?src-supplier=Digikey; ComponentLink8URL: https://datasheet.ciiva.com/6692/744311150-6692687.pdf?src-supplier=Digikey; ComponentLink8Description: https://datasheet.ciiva.com/6692/744311150-6692687.pdf?src-supplier=Digikey; ComponentLink9URL: https://datasheet.ciiva.com/48691/001087434-da-01-ml-we-hci-smd-hochstromind-744311150-de-en-48691386.pdf?src-supplier=Conrad; ComponentLink9Description: https://datasheet.ciiva.com/48691/001087434-da-01-ml-we-hci-smd-hochstromind-744311150-de-en-48691386.pdf?src-supplier=Conrad; Supplier Part Number 1: 732-1150-1-ND
L2 L3 = IND_0.47uH_4.5A_MCKK2012TR47M: Inductor Power Chip Multi-Layer 0.47uH 20% 1MHz Metal 3.1A 0.039Ohm DCR 0805 T/R; Manufacturer: Taiyo Yuden; Shielding: Shielded; DC Resistance (DCR): 39mR; Supplier 1: Digi-Key; Manufacturer Part Number: MCKK2012TR47M; RoHS: Yes; Category: Fixed Inductors; Stock 1: 59761; Pricing 1: 1=0.34, 10=0.279, 25=0.2572, 50=0.2358, 100=0.2079, 250=0.20152, 500=0.18008, 1000=0.14577 (USD); Mount: Surface Mount; Case/Package: 0805; Core Material: Metal; Case Code (Metric): 2012; Min Operating Temperature: -40°C; Max Operating Temperature: 125°C; Packaging: Cut Tape; Tolerance: 20%; Test Frequency: 1MHz; Series: MCOIL™, MC; RoHS Compliant: Yes; ComponentLink1URL: https://ds.yuden.co.jp/TYCOMPAS/ut/detail?pn=MCKK2012TR47M &amp;u=M&src-supplier=Digi-Key; ComponentLink1Description: https://ds.yuden.co.jp/TYCOMPAS/ut/detail?pn=MCKK2012TR47M &amp;u=M&src-supplier=Digi-Key; ComponentLink2URL: http://ds.yuden.co.jp/TYCOMPAS/ut/detail.do?productNo=MCKK2012TR47M&fileName=MCKK2012TR47M_SS&mode=specSheetDownload&src-supplier=Digi-Key; ComponentLink2Description: http://ds.yuden.co.jp/TYCOMPAS/ut/detail.do?productNo=MCKK2012TR47M&fileName=MCKK2012TR47M_SS&mode=specSheetDownload&src-supplier=Digi-Key; ComponentLink3URL: http://ds.yuden.co.jp/TYCOMPAS/ut/detail.do?productNo=MCKK2012TR47M&amp;fileName=MCKK2012TR47M_SS&amp;mode=specSheetDownload&src-supplier=Digi-Key; ComponentLink3Description: http://ds.yuden.co.jp/TYCOMPAS/ut/detail.do?productNo=MCKK2012TR47M&amp;fileName=MCKK2012TR47M_SS&amp;mode=specSheetDownload&src-supplier=Digi-Key; Supplier Part Number 1: 587-5632-1-ND; Case Code (Imperial): 0805
L4-L8 = IND_1UH_3A_WPN252012H1R0MT: Fixed Ind 1.020%UH 0.048 Ohm 4200; Manufacturer: Sunlord; Supplier 1: Digi-Key; Manufacturer Part Number: WPN252012H1R0MT; RoHS: Yes; Category: Fixed Inductors; Stock 1: 17941; Pricing 1: 1=0.39, 10=0.333, 25=0.3056, 50=0.2778, 100=0.2472, 250=0.23332, 500=0.19998, 1000=0.17776 (USD); Supplier Part Number 1: 3442-WPN252012H1R0MTCT-ND
Q1 = TRANS_FET_CH_P_12V_4.3A_IRLML6401TRPBF: Mosfet, Power; P-ch; Vdss -12V; Rds(on) 0.05 Ohm; Id -4.3A; MICRO3; Pd 1.3W; Vgs +/-8V; Manufacturer: Infineon; Continuous Drain Current (ID): 4.3A; Input Capacitance: 830pF; Rds On Max: 50mR; Nominal Vgs: -550mV; Number of Channels: 1; Fall Time: 210ns; Supplier 1: Mouser; Manufacturer Part Number: IRLML6401TRPBF; RoHS: Yes; Category: MOSFETs; Stock 1: 257081; Pricing 1: 1=0.47, 10=0.259, 50=0.259, 100=0.161, 1000=0.144, 10000=0.088 (USD); Mount: Surface Mount; Case/Package: SOT-23; Number of Pins: 3; Min Operating Temperature: -55°C; Max Operating Temperature: 150°C; Drain to Source Voltage (Vdss): -12V; Packaging: Cut Tape; Max Power Dissipation: 1.3W; Series: HEXFET®; Dual Supply Voltage: -12V; Threshold Voltage: -550mV; Max Dual Supply Voltage: -12V; Current Rating: -4.3A; Package Quantity: 3000; Resistance: 50mR; Voltage Rating (DC): -12V; Number of Elements: 1; On-State Resistance: 50mR; Termination: SMD/SMT; Radiation Hardening: No; RoHS Compliant: Yes; Lead Free: Lead Free; Reach SVHC Compliant: No; Halogen Free: Halogen Free; ComponentLink1URL: http://www.farnell.com/datasheets/1912227.pdf?src-supplier=Farnell; ComponentLink1Description: http://www.farnell.com/datasheets/1912227.pdf?src-supplier=Farnell; ComponentLink2URL: https://www.infineon.com/dgdl/irlml6401pbf.pdf?fileId=5546d462533600a401535668b96d2634&src-supplier=Digikey; ComponentLink2Description: https://www.infineon.com/dgdl/irlml6401pbf.pdf?fileId=5546d462533600a401535668b96d2634&src-supplier=Digikey; ComponentLink3URL: http://datasheet.octopart.com/IRLML6401TRPBF-International-Rectifier-datasheet-66727.pdf?src-supplier=Future+Electronics; ComponentLink3Description: http://datasheet.octopart.com/IRLML6401TRPBF-International-Rectifier-datasheet-66727.pdf?src-supplier=Future+Electronics; ComponentLink4URL: http://www.farnell.com/datasheets/1912227.pdf?src-supplier=Newark; ComponentLink4Description: http://www.farnell.com/datasheets/1912227.pdf?src-supplier=Newark; ComponentLink5URL: https://datasheet.octopart.com/IRLML6401TRPBF-Infineon-datasheet-41193306.pdf?src-supplier=Newark; ComponentLink5Description: https://datasheet.octopart.com/IRLML6401TRPBF-Infineon-datasheet-41193306.pdf?src-supplier=Newark; ComponentLink6URL: http://datasheet.octopart.com/IRLML6401TRPBF-International-Rectifier-datasheet-66727.pdf?src-supplier=Rs; ComponentLink6Description: http://datasheet.octopart.com/IRLML6401TRPBF-International-Rectifier-datasheet-66727.pdf?src-supplier=Rs; ComponentLink7URL: http://www.farnell.com/datasheets/1912227.pdf?src-supplier=Element14; ComponentLink7Description: http://www.farnell.com/datasheets/1912227.pdf?src-supplier=Element14; ComponentLink8URL: https://datasheet.octopart.com/IRLML6401TRPBF-International-Rectifier-datasheet-10898914.pdf?src-supplier=Element14; ComponentLink8Description: https://datasheet.octopart.com/IRLML6401TRPBF-International-Rectifier-datasheet-10898914.pdf?src-supplier=Element14; Supplier Part Number 1: 942-IRLML6401TRPBF
Q2 Q4 = TRANS_FET_CH_N_30V_0.1A: Trans Mosfet N-ch 30V 0.1A 3-PIN SOT-323 T/r; Manufacturer: MCC; Continuous Drain Current (ID): 100mA; Rds On Max: 8R; Input Capacitance: 13pF; Max Power Dissipation: 200mW; Supplier 1: Digi-Key; Manufacturer Part Number: 2SK3018-TP; RoHS: Yes; Stock 1: 57538; Pricing 1: 1=0.41, 10=0.289, 100=0.1458, 500=0.11898, 1000=0.08827 (USD); Mount: Surface Mount; Case/Package: SOT-323; Min Operating Temperature: -55°C; Max Operating Temperature: 150°C; Packaging: Cut Tape; Drain to Source Voltage (Vdss): 30V; Series: -; RoHS Compliant: Yes; ComponentLink1URL: http://www.mccsemi.com/up_pdf/2SK3018(SOT-323).pdf?src-supplier=Digi-Key; ComponentLink1Description: http://www.mccsemi.com/up_pdf/2SK3018(SOT-323).pdf?src-supplier=Digi-Key; Supplier Part Number 1: 2SK3018-TPMSCT-ND
Q3 = TRANS_FET_CH_N_50V_0.2A_RYU002N05T306: Trans MOSFET N-CH Si 50V 0.2A 3-Pin UMT T/R; Manufacturer: Rohm; Continuous Drain Current (ID): 200mA; Supplier 1: Verical; Manufacturer Part Number: RYU002N05T306; RoHS: Yes; Category: MOSFETs; Stock 1: 3000; Pricing 1: 705=0.1073, 1000=0.1038, 2500=0.1007 (USD); Drain to Source Voltage (Vdss): 50V; Lead Free: Lead Free; RoHS Compliant: Yes; Supplier Part Number 1: RYU002N05T306
R1 = RES_3.3R_1%_125mW_0603: Thick Film Chip Resistor 0603 SMD 3.3 Ohm 1% 0.125W(1/8W) 200ppm/C; Manufacturer: KOA Speer; Voltage Rating: 50V; Power Rating: 100mW; Temperature Coefficient: 200ppm/°C; Max Power Dissipation: 125mW; Supplier 1: Digikey; Manufacturer Part Number: RK73H1JTTD3R30F; RoHS: Yes; Category: Chip SMD Resistors; Stock 1: 68759; Pricing 1: 1=0.1, 10=0.023, 50=0.0146, 100=0.0122, 500=0.00832, 1000=0.00717 (USD); Case/Package: 0603; Number of Pins: 2; Case Code (Metric): 1608; Min Operating Temperature: -55°C; Max Operating Temperature: 155°C; Packaging: Tape and Reel; Resistor Type: Thick Film; Termination: SMD/SMT; Series: RK73H; Construction: Rectangular; Resistance Tolerance: 1%; Features: Moisture Resistant,Automotive AEC-Q200; Number of Terminations: 2; Length: 1.6mm; Depth: 0.8mm; Ratings: AEC-Q200; Military Standard: Not; Lead Free: Lead Free; RoHS Compliant: Yes; ComponentLink1URL: https://datasheet.ciiva.com/5556/rk73h-5556827.pdf?src-supplier=Mouser; ComponentLink1Description: https://datasheet.ciiva.com/5556/rk73h-5556827.pdf?src-supplier=Mouser; ComponentLink2URL: https://datasheet.ciiva.com/48426/rk73h-series-eng-jap-tds-48426603.pdf?src-supplier=Distrelec; ComponentLink2Description: https://datasheet.ciiva.com/48426/rk73h-series-eng-jap-tds-48426603.pdf?src-supplier=Distrelec; ComponentLink3URL: https://datasheet.ciiva.com/7816/549017-7816815.pdf?src-supplier=Element14; ComponentLink3Description: https://datasheet.ciiva.com/7816/549017-7816815.pdf?src-supplier=Element14; Supplier Part Number 1: 2019-RK73H1JTTD3R30FCT-ND
R2 R17 R23 R31 R33-R39 = RES_0R_5%_100mW_0402: SMD Chip Resistor, Jumper, 0 ohm, 100 mW, 0402 [1005 Metric], Thick Film, General Purpose; Manufacturer: Panasonic; Power Rating: 100mW; Voltage Rating: 50V; Temperature Coefficient: 600ppm/°C; Supplier 1: Mouser; Manufacturer Part Number: ERJ-2GE0R00X; RoHS: Yes; Category: Chip SMD Resistors; Stock 1: 10989354; Pricing 1: 1=0.1, 10=0.013, 50=0.013, 100=0.006, 1000=0.004, 2500=0.003, 10000=0.003 (USD); Mount: Surface Mount; Case/Package: 0402; Contact Plating: Tin; Case Code (Metric): 1005; Size Code: 0402; Min Operating Temperature: -55°C; Max Operating Temperature: 155°C; Resistor Type: Thick Film; Packaging: Cut Tape; Package Quantity: 10000; Number of Terminations: 2; Termination: SMD/SMT; Max Power Dissipation: 100mW; Voltage Rating (DC): 50V; Features: Automotive AEC-Q200; Series: ERJ; Construction: Rectangular; Technology: THICK FILM; Length: 1mm; Width: 0.5mm; Height: 0.35mm; Depth: 0.5mm; Ratings: AEC-Q200; Radiation Hardening: No; Reach SVHC Compliant: No; Military Standard: Not; Lead Free: Lead Free; RoHS Compliant: Yes; ComponentLink1URL: https://datasheet.ciiva.com/11821/0900766b80f806dd-11821176.pdf?src-supplier=Rs; ComponentLink1Description: https://datasheet.ciiva.com/11821/0900766b80f806dd-11821176.pdf?src-supplier=Rs; ComponentLink2URL: https://datasheet.ciiva.com/43460/1678796-43460347.pdf?src-supplier=Farnell; ComponentLink2Description: https://datasheet.ciiva.com/43460/1678796-43460347.pdf?src-supplier=Farnell; ComponentLink3URL: https://datasheet.ciiva.com/46389/1678796-46389518.pdf?src-supplier=Element14; ComponentLink3Description: https://datasheet.ciiva.com/46389/1678796-46389518.pdf?src-supplier=Element14; ComponentLink4URL: https://datasheet.ciiva.com/5959/1678796-5959692.pdf?src-supplier=Farnell; ComponentLink4Description: https://datasheet.ciiva.com/5959/1678796-5959692.pdf?src-supplier=Farnell; ComponentLink5URL: https://datasheet.ciiva.com/28695/1678796-28695758.pdf?src-supplier=Element14; ComponentLink5Description: https://datasheet.ciiva.com/28695/1678796-28695758.pdf?src-supplier=Element14; ComponentLink6URL: https://datasheet.ciiva.com/16783/70260739-16783734.pdf?src-supplier=Allied+Electronics; ComponentLink6Description: https://datasheet.ciiva.com/16783/70260739-16783734.pdf?src-supplier=Allied+Electronics; ComponentLink7URL: https://datasheet.ciiva.com/16778/70260739-16778335.pdf?src-supplier=Allied+Electronics; ComponentLink7Description: https://datasheet.ciiva.com/16778/70260739-16778335.pdf?src-supplier=Allied+Electronics; ComponentLink8URL: https://datasheet.ciiva.com/48531/aoa0000ce1-48531077.pdf?src-supplier=Avnet; ComponentLink8Description: https://datasheet.ciiva.com/48531/aoa0000ce1-48531077.pdf?src-supplier=Avnet; ComponentLink9URL: https://datasheet.ciiva.com/30097/4aoa0000ce1-30097116.pdf?src-supplier=Onlinecomponents.com; ComponentLink9Description: https://datasheet.ciiva.com/30097/4aoa0000ce1-30097116.pdf?src-supplier=Onlinecomponents.com; Supplier Part Number 1: 667-ERJ-2GE0R00X
R3 R18 = RES_1M_1%_63mW_0402: Res Thick Film 0402 1M Ohm 1% 1/16W ±100ppm/°C Molded SMD SMD Paper Tape on Plastic Reel; Manufacturer: Bourns; Power Rating: 62.5mW; Voltage Rating: 50V; Max Power Dissipation: 63mW; Supplier 1: Digi-Key; Manufacturer Part Number: CR0402-FX-1004GLF; RoHS: Yes; Category: Chip SMD Resistors; Stock 1: 506989; Pricing 1: 1=0.1, 10=0.012, 50=0.0064, 100=0.0052, 500=0.00332, 1000=0.0028, 5000=0.00193 (USD); Mount: Surface Mount; Case Code (Metric): 1005; Case Code (Imperial): 0402; Contact Plating: Tin; Min Operating Temperature: -55°C; Max Operating Temperature: 125°C; Package Quantity: 10000; Packaging: Tape and Reel; Number of Terminations: 2; Termination: SMD/SMT; Temperature Coefficient: 100ppm/°C; Series: CR0402; Voltage Rating (DC): 50V; Length: 1mm; Width: 0.5mm; Height: 0.35mm; Thickness: 356um; Radiation Hardening: No; RoHS Compliant: Yes; ComponentLink1URL: http://www.mouser.com/ds/2/54/CR0402-72074.pdf?src-supplier=Mouser; ComponentLink1Description: http://www.mouser.com/ds/2/54/CR0402-72074.pdf?src-supplier=Mouser; ComponentLink2URL: http://www.farnell.com/datasheets/2194437.pdf?src-supplier=Farnell; ComponentLink2Description: http://www.farnell.com/datasheets/2194437.pdf?src-supplier=Farnell; ComponentLink3URL: http://components.arrow.com/part/dataview/41873878S8356545N1506?src-supplier=Arrow+Electronics; ComponentLink3Description: http://components.arrow.com/part/dataview/41873878S8356545N1506?src-supplier=Arrow+Electronics; ComponentLink4URL: https://datasheet.octopart.com/CR0402-FX-1004GLF-Bourns-datasheet-68301632.pdf?src-supplier=Farnell; ComponentLink4Description: https://datasheet.octopart.com/CR0402-FX-1004GLF-Bourns-datasheet-68301632.pdf?src-supplier=Farnell; ComponentLink5URL: http://www.bourns.com/pdfs/CR0402.pdf?src-supplier=Avnet; ComponentLink5Description: http://www.bourns.com/pdfs/CR0402.pdf?src-supplier=Avnet; ComponentLink6URL: https://www.bourns.com/docs/Product-Datasheets/CR0402.pdf?src-supplier=Digi-Key; ComponentLink6Description: https://www.bourns.com/docs/Product-Datasheets/CR0402.pdf?src-supplier=Digi-Key; ComponentLink7URL: http://www.farnell.com/datasheets/2194437.pdf?src-supplier=Element14; ComponentLink7Description: http://www.farnell.com/datasheets/2194437.pdf?src-supplier=Element14; ComponentLink8URL: http://www.farnell.com/datasheets/2194437.pdf?src-supplier=Newark; ComponentLink8Description: http://www.farnell.com/datasheets/2194437.pdf?src-supplier=Newark; ComponentLink9URL: https://datasheet.octopart.com/CR0402-FX-1004GLF-Bourns-datasheet-159578630.pdf?src-supplier=Electro+Sonic; ComponentLink9Description: https://datasheet.octopart.com/CR0402-FX-1004GLF-Bourns-datasheet-159578630.pdf?src-supplier=Electro+Sonic; ComponentLink10URL: https://datasheet.octopart.com/CR0402-FX-1004GLF-Bourns-datasheet-140567134.pdf?src-supplier=Arrow.cn; ComponentLink10Description: https://datasheet.octopart.com/CR0402-FX-1004GLF-Bourns-datasheet-140567134.pdf?src-supplier=Arrow.cn; Supplier Part Number 1: CR0402-FX-1004GLFCT-ND
R4 R5 = RES_44.2K_1%_100mW_0402: SMD Chip Resistor, 44.2 kOhm, ± 1%, 100 mW, 0402 [1005 Metric], Thick Film, Precision; Manufacturer: Panasonic; Power Rating: 100mW; Voltage Rating: 50V; Temperature Coefficient: 100ppm/°C; Supplier 1: Digikey; Manufacturer Part Number: ERJ-2RKF4422X; RoHS: Yes; Category: Chip SMD Resistors; Stock 1: 103952; Pricing 1: 1=0.1, 10=0.024, 50=0.0152, 100=0.0125, 500=0.0084, 1000=0.0072, 5000=0.00523 (USD); Mount: Surface Mount; Case Code (Metric): 1005; Case Code (Imperial): 0402; Contact Plating: Tin; Size Code: 0402; Min Operating Temperature: -55°C; Max Operating Temperature: 155°C; Packaging: Tape and Reel; Package Quantity: 1; Resistor Type: Thick Film; Number of Terminations: 2; Termination: SMD/SMT; Max Power Dissipation: 100mW; Voltage Rating (DC): 50V; Features: Automotive AEC-Q200; Series: ERJ; Construction: Rectangular; Technology: THICK FILM; Length: 1mm; Width: 0.5mm; Height: 0.35mm; Depth: 0.5mm; Ratings: AEC-Q200; Reach SVHC Compliant: No; Military Standard: Not; Lead Free: Lead Free; RoHS Compliant: Yes; ComponentLink1URL: https://datasheet.ciiva.com/6201/426256-6201371.pdf?src-supplier=Farnell; ComponentLink1Description: https://datasheet.ciiva.com/6201/426256-6201371.pdf?src-supplier=Farnell; ComponentLink2URL: https://datasheet.ciiva.com/43460/426256-43460329.pdf?src-supplier=Farnell; ComponentLink2Description: https://datasheet.ciiva.com/43460/426256-43460329.pdf?src-supplier=Farnell; ComponentLink3URL: https://datasheet.ciiva.com/9189/aoa0000ce2-9189558.pdf?src-supplier=Avnet; ComponentLink3Description: https://datasheet.ciiva.com/9189/aoa0000ce2-9189558.pdf?src-supplier=Avnet; ComponentLink4URL: https://datasheet.ciiva.com/24068/aoa0000ce2-24068685.pdf?src-supplier=Mouser; ComponentLink4Description: https://datasheet.ciiva.com/24068/aoa0000ce2-24068685.pdf?src-supplier=Mouser; ComponentLink5URL: https://datasheet.ciiva.com/46377/426256-46377851.pdf?src-supplier=Element14; ComponentLink5Description: https://datasheet.ciiva.com/46377/426256-46377851.pdf?src-supplier=Element14; ComponentLink6URL: https://datasheet.ciiva.com/30202/aoa0000ce2-30202310.pdf?src-supplier=Onlinecomponents.com; ComponentLink6Description: https://datasheet.ciiva.com/30202/aoa0000ce2-30202310.pdf?src-supplier=Onlinecomponents.com; ComponentLink7URL: https://datasheet.ciiva.com/28685/1678782-28685308.pdf?src-supplier=Element14; ComponentLink7Description: https://datasheet.ciiva.com/28685/1678782-28685308.pdf?src-supplier=Element14; ComponentLink8URL: https://datasheet.ciiva.com/16440/aoa0000ce2-16440205.pdf?src-supplier=Future+Electronics; ComponentLink8Description: https://datasheet.ciiva.com/16440/aoa0000ce2-16440205.pdf?src-supplier=Future+Electronics; ComponentLink9URL: https://datasheet.ciiva.com/16758/70260748-16758632.pdf?src-supplier=Allied+Electronics; ComponentLink9Description: https://datasheet.ciiva.com/16758/70260748-16758632.pdf?src-supplier=Allied+Electronics; ComponentLink10URL: https://datasheet.ciiva.com/16782/70260748-16782984.pdf?src-supplier=Allied+Electronics; ComponentLink10Description: https://datasheet.ciiva.com/16782/70260748-16782984.pdf?src-supplier=Allied+Electronics; Supplier Part Number 1: P44.2KLDKR-ND; Resistance Tolerance: 1%